# Altium schematic sheet Bottom_board.schdoc
size 200 x 81 mm
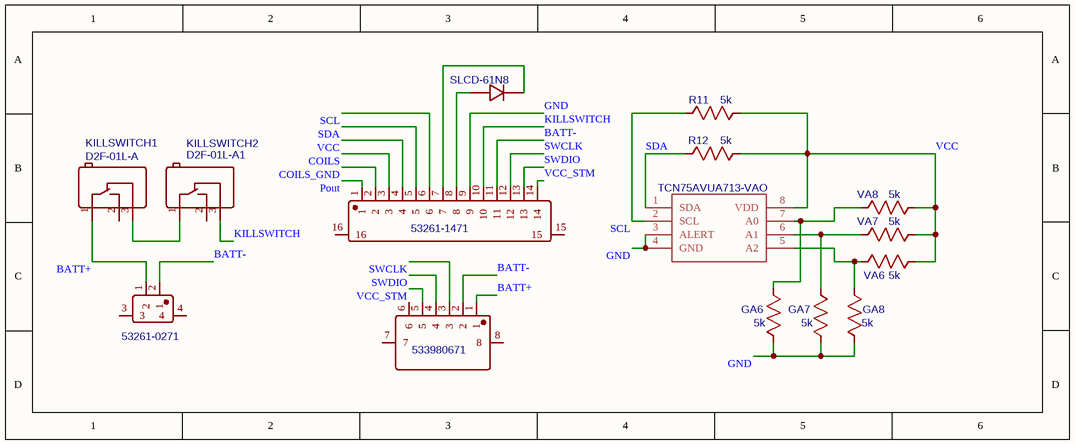
[diagram p0: Bottom_board.schdoc]

## Parts
CN1  53261-0271  [CONN-SMD_532610271]
CN2  53261-1471  [CONN-SMD_532611471]
D8  SLCD-61N8  [SOD-123_L2.8-W1.8-LS3.7-RD]
GA6  5k  [R0805]
GA7  5k  [R0805]
GA8  5k  [R0805]
IC3  TCN75AVUA713-VAO  [SOP65P490X110-8N]
KILLSWITCH1  D2F-01L-A  [SW-TH_D2F-01L]
KILLSWITCH2  D2F-01L-A1  [SW-TH_D2F-01L]
R11  5k  [R0805]
R12  5k  [R0805]
U8  533980671  [CONN-SMD_6P-P1.25-V-M_533980671]
VA6  5k  [R0805]
VA7  5k  [R0805]
VA8  5k  [R0805]

## Nets
BATT+: CN1.1(2) KILLSWITCH1.1(COM) U8.1
BATT-: CN1.2(1) CN2.11 U8.2
COILS: CN2.3
COILS_GND: CN2.2
GND: CN2.9 GA6.1 GA7.1 GA8.1 IC3.3(ALERT) IC3.4(GND)
KILLSWITCH: CN2.10 KILLSWITCH2.3(NC)
Pout: CN2.1
SCL: CN2.6 IC3.2(SCL) R11.1
SDA: CN2.5 IC3.1(SDA) R12.1
SWCLK: CN2.12 U8.3
SWDIO: CN2.13 U8.4
VCC: CN2.4 IC3.8(VDD) R11.2 R12.2 VA6.2 VA7.2 VA8.2
VCC_STM: CN2.14 U8.5
NetCN2_7: CN2.7 D8.1
NetCN2_8: CN2.8 D8.2
NetGA6_2: GA6.2 IC3.7(A0) VA8.1
NetGA7_2: GA7.2 IC3.6(A1) VA7.1
NetGA8_2: GA8.2 IC3.5(A2) VA6.1
NetKILLSWITCH1_3: KILLSWITCH1.3(NC) KILLSWITCH2.1(COM)

Not connected (* = marked no-connect by the designer): CN1 3 4; CN2 15 16; KILLSWITCH1 2(NO); KILLSWITCH2 2(NO); U8 6 7 8

## Library data of the parts
CN1 = 53261-0271: BOM_Manufacturer: MOLEX; BOM_Manufacturer Part: 532610271; Contributor: LCSC; BOM_Supplier: LCSC; BOM_Supplier Part: C189700; BOM_JLCPCB Part Class: Extended Part; spicePre: C; spiceSymbolName: 532610271
CN2 = 53261-1471: BOM_Manufacturer: MOLEX; BOM_Manufacturer Part: 532611471; Contributor: LCSC; BOM_Supplier: LCSC; BOM_Supplier Part: C505101; BOM_JLCPCB Part Class: Extended Part; spicePre: C; spiceSymbolName: 532611471
D8 = SLCD-61N8: BOM_Manufacturer: BLUE ROCKET; BOM_Manufacturer Part: 1N4007W; Contributor: Blothr; BOM_Supplier Part: C328592; spicePre: D; spiceSymbolName: SLCD-61N8
GA6-GA8 R11 R12 VA6-VA8 = 5k: BOM_Manufacturer Part: CRCW08055K00JNTA; BOM_Manufacturer: Vishay / Dale; nameAlias: Value(Ω); Contributor: LCEDA_Lib; BOM_Supplier Part: 71-CRCW0805J-5K; BOM_Supplier: Mouser; spicePre: R; spiceSymbolName: R_0603_US; BOM_Link: https://www.mouser.es/ProductDetail/Vishay-Dale/CRCW08055K00JNTA?qs=%2Fha2pyFadui6t5gBae62ocFJ46SNue422n5luvT1xmc7fnXInubqKA%3D%3D
KILLSWITCH1 = D2F-01L-A: BOM_Manufacturer: Omron Electronics; Contributor: LCSC; SMT Type: Extend; BOM_Paste Type: expand; BOM_Supplier: LCSC; BOM_Supplier Part: C231335; BOM_Manufacturer Part: D2F-01L; BOM_LCSC Assembly: Yes; spicePre: S; spiceSymbolName: D2F-01L-A
KILLSWITCH2 = D2F-01L-A1: BOM_Manufacturer: Omron Electronics; Contributor: LCSC; SMT Type: Extend; BOM_Paste Type: expand; BOM_Supplier: LCSC; BOM_Supplier Part: C231335; BOM_Manufacturer Part: D2F-01L; BOM_LCSC Assembly: Yes; spicePre: S; spiceSymbolName: D2F-01L-A
U8 = 533980671: BOM_Manufacturer: MOLEX; Contributor: LCSC; BOM_Supplier: LCSC; BOM_Supplier Part: C277393; BOM_Manufacturer Part: 533980671; BOM_JLCPCB Part Class: Extended Part; spicePre: U; spiceSymbolName: 533980671
IC3 = TCN75AVUA713-VAO: spicePre: I; spiceSymbolName: TCN75AVUA713-VAO